# EAGLE design backscatter_power_module_v1_1 (EAGLE 7.3.0)
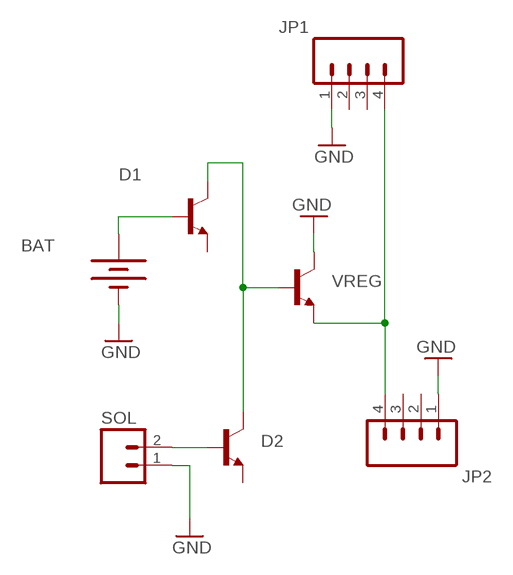
[diagram p0: schematic, sheet 1]

## Parts
BAT  BATTERY20PTH_LAB  [BATTCOM_20MM_PTH]
D1  TRANSISTOR_NPNSOT23  [SOT23]
D2  TRANSISTOR_NPNSOT23  [SOT23]
JP1  M04LOCK  [1X04_LOCK]
JP2  M04LOCK  [1X04_LOCK]
SOL  M02LOCK  [1X02_LOCK]
VREG  TRANSISTOR_NPNSOT23  [SOT23]

## Nets
GND: BAT.2(-) JP1.1 JP2.1 SOL.1 VREG.3(C)
N$1: JP1.4 JP2.4 VREG.2(E)
N$2: BAT.1(+) D1.1(B)
N$5: D2.1(B) SOL.2
N$6: D1.3(C) D2.3(C) VREG.1(B)
Unconnected: D1.2(E) D2.2(E) JP1.2 JP1.3 JP2.2 JP2.3

## Library data of the parts
BAT = semipassiveTag_library:BATTERY: Battery Holders Various common sizes : AA, AAA, 20mm coin cell and 12mm coin cell.
D1 D2 VREG = SparkFun:TRANSISTOR_NPN: Transistor NPN BJT configuration in SOT23 package. MMBT2222 is the common NPN we use. Double check BCE configuration again layout.
JP1 JP2 = SparkFun-Connectors:M04: Header 4 Standard 4-pin 0.1" header. Use with straight break away headers (SKU : PRT-00116), right angle break away headers (PRT-00553), swiss pins (PRT-00743), machine pins (PRT-00117), and female headers (PRT-00115). Molex polarized connector foot print use with SKU : PRT-08231 with associated crimp pins and housings. 1MM SMD Version SKU: PRT-10208
SOL = SparkFun-Connectors:M02: Header 2 Standard 2-pin 0.1" header. Use with straight break away headers (SKU : PRT-00116), right angle break away headers (PRT-00553), swiss pins (PRT-00743), machine pins (PRT-00117), and female headers (PRT-00115). Molex polarized connector foot print use with SKU : PRT-08233 with associated crimp pins and housings.

## Board
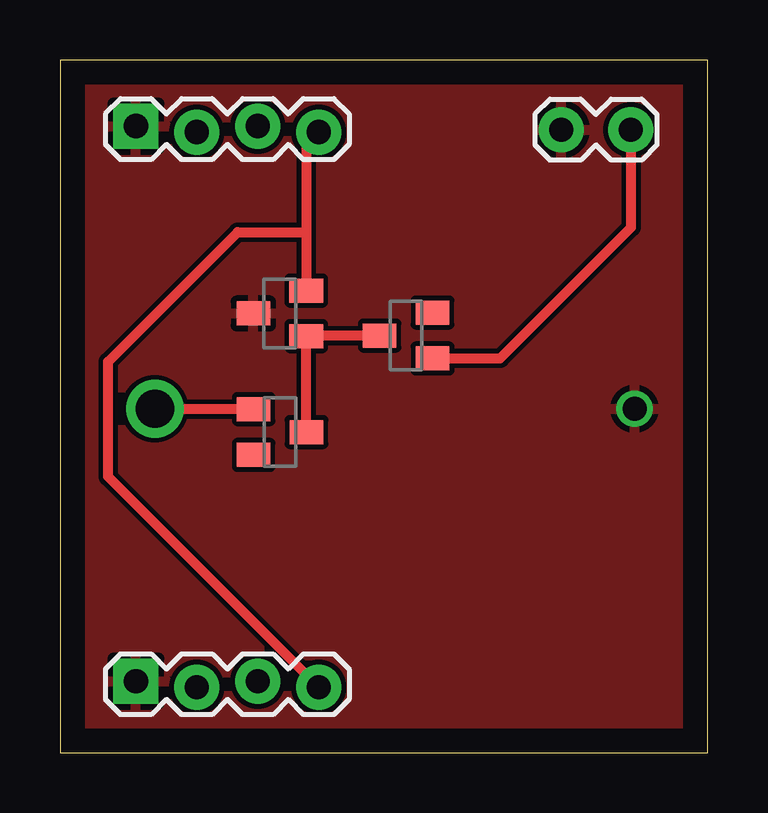
[diagram p1: board, top side]
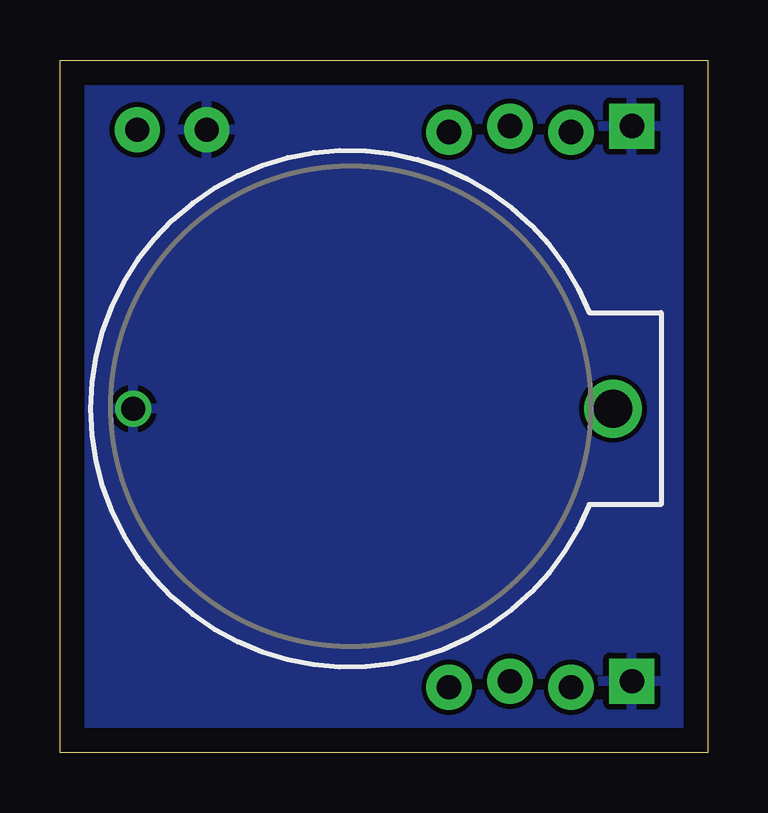
[diagram p2: board, bottom side, seen from below]

Size 26.99 x 28.87 mm. Coordinates in mm from the lower left corner, seen from the top.
Outline: 0,0 26.99,0 26.99,28.87 0,28.87 0,0
Copper layers (1*16): Top 0.035mm / dielectric 1.5mm / Bottom 0.035mm
Design rules "default": minimum track width 10mil, minimum drill 24mil, track to track 8mil, track to pad 8mil, pad to pad 8mil, via to via 8mil, smd to smd 8mil, copper to edge 40mil, drill to drill 8mil, minimum pad ring 10mil, minimum via ring 8mil, stop-mask expansion 4mil, vias tented up to drill 0mil, thermal gap 10mil

### Footprints (pad centres in the part's own frame; a part is rotated, then mirrored left to right if it is on the bottom)
BATTCOM_20MM_PTH = drill 1.6: 1 19.99,0 | drill 1: 2 0,0
SOT23 = smd 1 x 1.4: 1 -0.95,-1.1; 2 0.95,-1.1; 3 0,1.1
1X04_LOCK = drill 1.016 pad 1.88 square: 1 0,0.127 | drill 1.016 pad 1.88: 2 2.54,-0.127; 3 5.08,0.127; 4 7.62,-0.127
1X02_LOCK = drill 1 pad 1.88: 1 -0.178,0; 2 2.718,0

### Placement (x,y rotation side)
BAT  23.94,14.34 0 bottom
D1  9.17,13.37 270 top
D2  14.42,17.39 90 top
JP1  3.16,2.86 0 top
JP2  3.16,25.99 0 top
SOL  21.06,25.97 0 top
VREG  9.16,18.31 90 top

### Tracks (layer width: path | path; a pad name or v marks a point on that pad's centre or on a via)
GND
  pour Top: 15.14,40.74 43.08,40.74 43.08,-12.6 -14.07,-12.6 -14.07,40.74
  pour Bottom: -4,37.6 31.4,37.6 31.4,-7.1 -4,-7.1
N$1
  Top 0.406: JP2.4 10.26,25.34 10.26,21.7 | 10.26,21.7 VREG.2 | JP1.4 2,11.51 2,16.3 7.4,21.7 10.26,21.7
N$2
  Top 0.406: D1.1 3.95,14.32 BAT.1
N$5
  Top 0.406: D2.1 18.34,16.44 23.8,21.9 23.8,25.95 SOL.2
N$6
  Top 0.406: D1.3 VREG.1 10.26,17.39 D2.3